# EAGLE design Adafruit TB6612 (EAGLE 6.6.0)
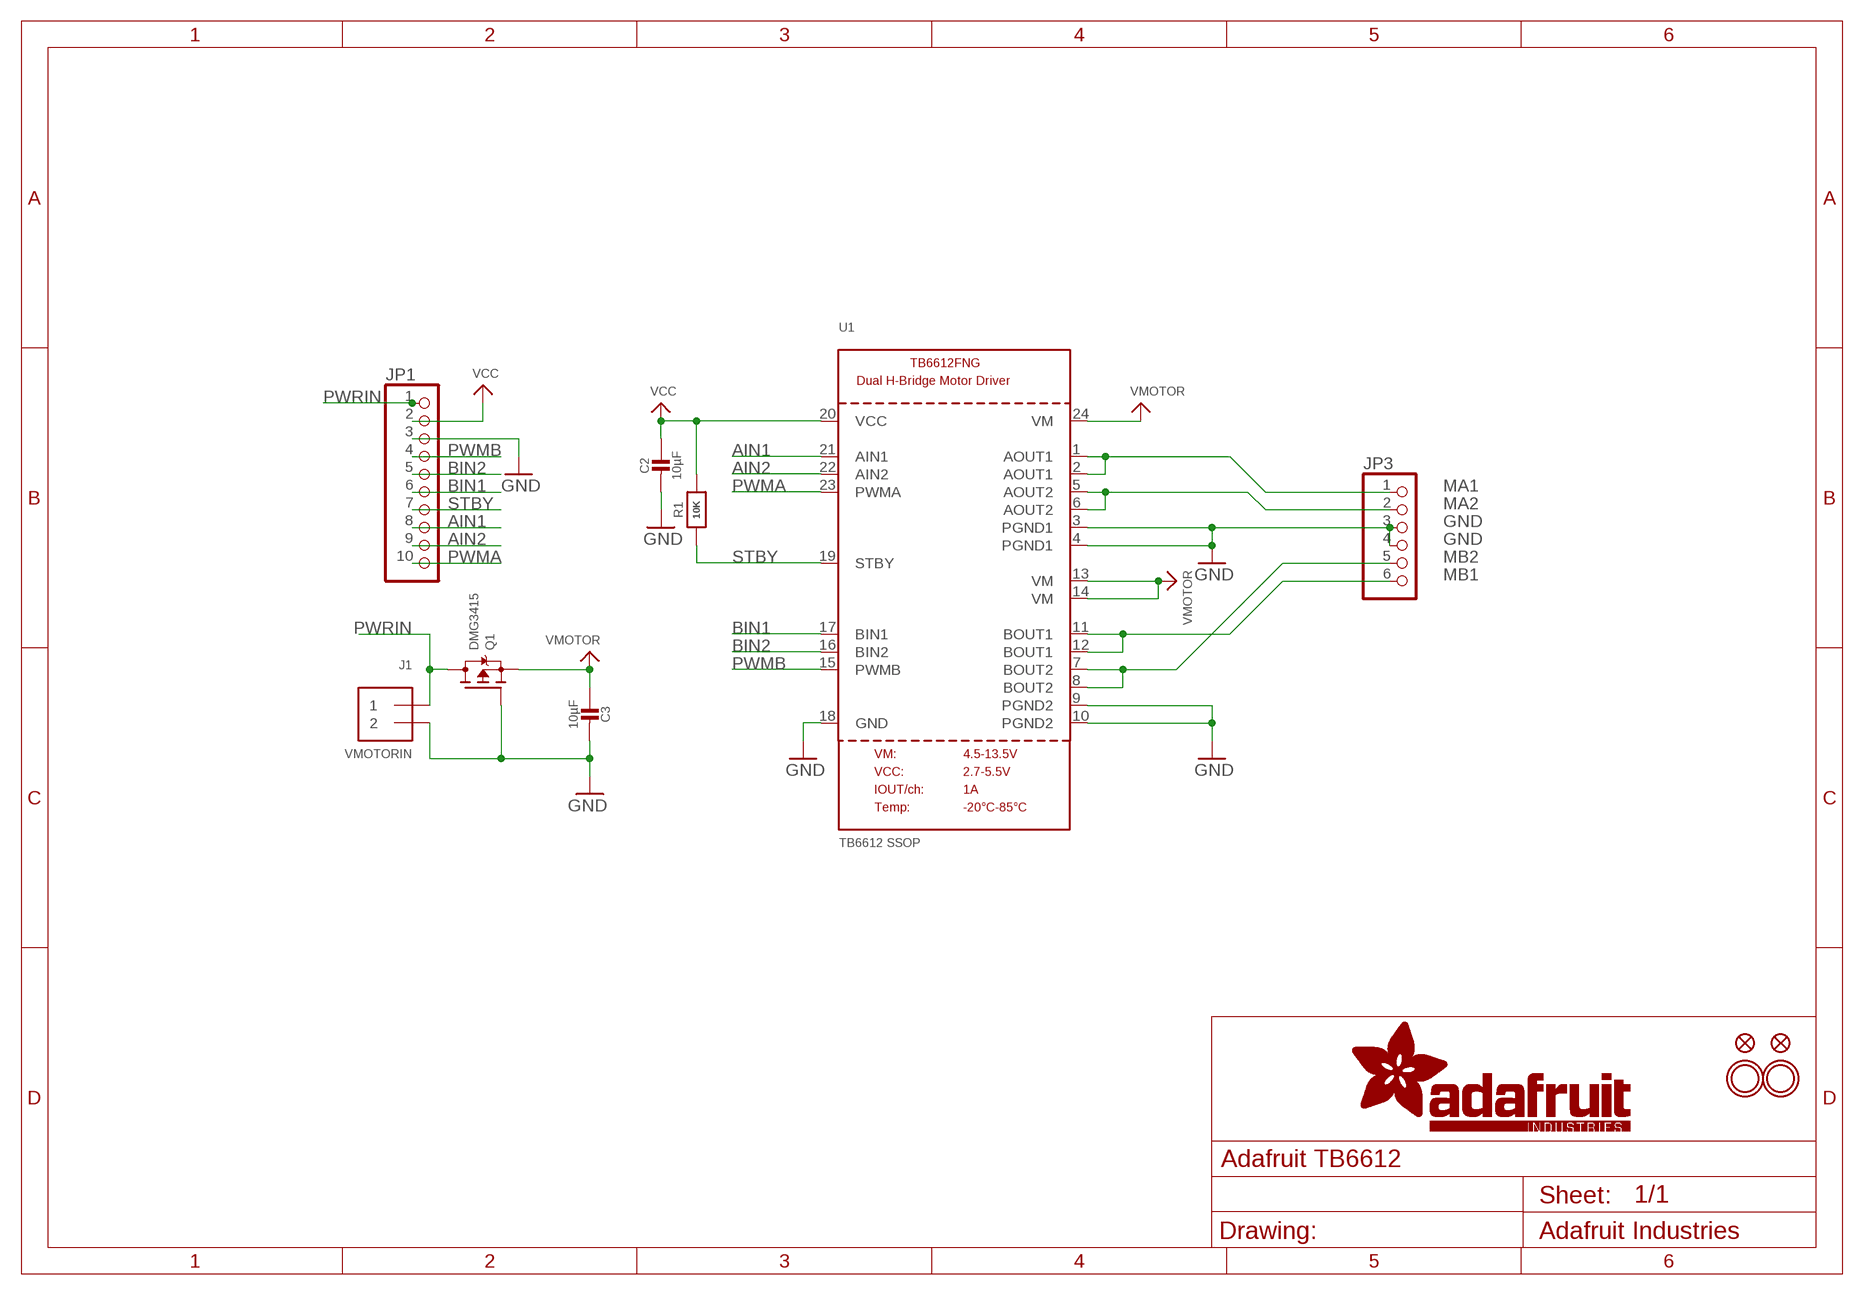
[diagram p0: schematic, sheet 1]

## Parts
C2  10µF  CAP_CERAMIC0805-NOOUTLINE  [0805-NO]
C3  10µF  CAP_CERAMIC0805-NOOUTLINE  [0805-NO]
FID1  FIDUCIAL""  [FIDUCIAL_1MM]
FID2  FIDUCIAL""  [FIDUCIAL_1MM]
J1  VMOTORIN  TERMBLOCK_1X2  [TERMBLOCK_1X2-3.5MM]
JP1  HEADER-1X10THICKER  [1X10_ROUND_76]
JP3  PINHD-1X6CB  [1X06-CLEANBIG]
Q1  DMG3415  MOSFET-PWIDE  [SOT23-WIDE]
R1  10K  RESISTOR0805_NOOUTLINE  [0805-NO]
U1  TB6612 SSOP  TB6612FNGSSOP  [SSOP24]
U$13  MOUNTINGHOLE2.5  [MOUNTINGHOLE_2.5_PLATED]
U$14  MOUNTINGHOLE2.5  [MOUNTINGHOLE_2.5_PLATED]

## Nets
AIN1: JP1.8 U1.21(AIN1)
AIN2: JP1.9 U1.22(AIN2)
BIN1: JP1.6 U1.17(BIN1)
BIN2: JP1.5 U1.16(BIN2)
GND: C2.2 C3.2 J1.2 JP1.3 JP3.3 JP3.4 Q1.1(G) U1.3(PGND1) U1.4(PGND1) U1.9(PGND2) U1.10(PGND2) U1.18(GND)
MA1: JP3.1 U1.1(AOUT1) U1.2(AOUT1)
MA2: JP3.2 U1.5(AOUT2) U1.6(AOUT2)
MB1: JP3.6 U1.11(BOUT1) U1.12(BOUT1)
MB2: JP3.5 U1.7(BOUT2) U1.8(BOUT2)
PWMA: JP1.10 U1.23(PWMA)
PWMB: JP1.4 U1.15(PWMB)
PWRIN: J1.1 JP1.1 Q1.3(D)
STBY: JP1.7 R1.1 U1.19(STBY)
VCC: C2.1 JP1.2 R1.2 U1.20(VCC)
VMOTOR: C3.1 Q1.2(S) U1.13(VM) U1.14(VM) U1.24(VM)

## Library data of the parts
C2 C3 = microbuilder:CAP_CERAMIC: Ceramic Capacitors For new designs, use the packages preceded by an '_' character since they are more reliable: The following footprints should be used on most boards: _0402 - Standard footprint for regular board layouts _0603 - Standard footprint for regular board layouts _0805 - Standard footprint for regular board layouts _1206 - Standard footprint for regular board layouts For extremely tight-pitch boards where space is at a premium, the following 'micro-pitch' footprints can be used (smaller pads, no silkscreen outline, etc.): _0402MP - Micro-pitch footprint for very dense/compact boards _0603MP - Micro-pitch footprint for very dense/compact boards _0805MP - Micro-pitch footprint for very dense/compact boards _1206MP - Micro-pitch footprint for very dense/compact boards
FID1 FID2 = microbuilder:FIDUCIAL: Fiducial Alignment Points Various fiducial points for machine vision alignment.; BOM: EXCLUDE
J1 = microbuilder:TERMBLOCK_1X2: 3.5mm Terminal block http://www.ladyada.net/library/pcb/eaglelibrary.html
JP1 = microbuilder:HEADER-1X10: PIN HEADER
JP3 = adafruit:PINHD-1X6: PIN HEADER
Q1 = microbuilder:MOSFET-P: P-Channel Mosfet LEGEND VDS: Voltage Drain-Source ID: Drain Current RDS(ON): Drain-Source On-State Resistance VGS(TH): Gate-Source Threshold Voltage CISS: Drain-Source Input Capacitance SOT-23 Name VDS ID RDS(ON) VGS(TH) CISS Order Number IRLML5103 30V 760mA 600 mOhm -- 75pF @ 25V Digikey: IRLML5103PBFCT-ND IRLML6401 12V 4.3A 50 mOhm 950mV @ 250µA 830pF @ 10V Digikey: IRLML6401PBFTR-ND NTR0202PL 20V 400mA 800 mOhm 2.3V @ 250uA 70pF @ 5V Digikey: NTR0202PLT1GOSTR-ND NTR4101PT1G 20V 1.8A 85 mOhm 1.2V @ 250uA 675pF @ 10V Digikey: NTR4101PT1GOSCT-ND DMP2004K 20V 600mA 900 mOhm 1V @ 250uA 175pF @ 16V Digikey: DMP2004KDICT-ND PMV65XP 20V 3.9A 76 mOhm 950mV @ 1mA 725pF @ 20V Digikey: 568-2358-2-ND TO-252 Name VDS ID RDS(ON) VGS(TH) CISS Order Number AOD417 30V 25A 34 mOhm 3V @ 250µA 920pF @ 15V Digikey: 785-1106-2-ND
R1 = microbuilder:RESISTOR: Resistors For new designs, use the packages preceded by an '_' character since they are more reliable: The following footprints should be used on most boards: _0402 - Standard footprint for regular board layouts _0603 - Standard footprint for regular board layouts _0805 - Standard footprint for regular board layouts _1206 - Standard footprint for regular board layouts For extremely tight-pitch boards where space is at a premium, the following 'micro-pitch' footprints can be used (smaller pads, no silkscreen outline, etc.): _0402MP - Micro-pitch footprint for very dense/compact boards _0603MP - Micro-pitch footprint for very dense/compact boards _0805MP - Micro-pitch footprint for very dense/compact boards _1206MP - Micro-pitch footprint for very dense/compact boards
U1 = microbuilder:TB6612FNG: TB6612FNG Dual H-Bridge Motor Driver
U$13 U$14 = microbuilder:MOUNTINGHOLE: Mounting Hole For #2 screws (0.086"/2.18mm width, 0.094"/2.4mm hole) use 2.5mm; BOM: EXCLUDE

## Board
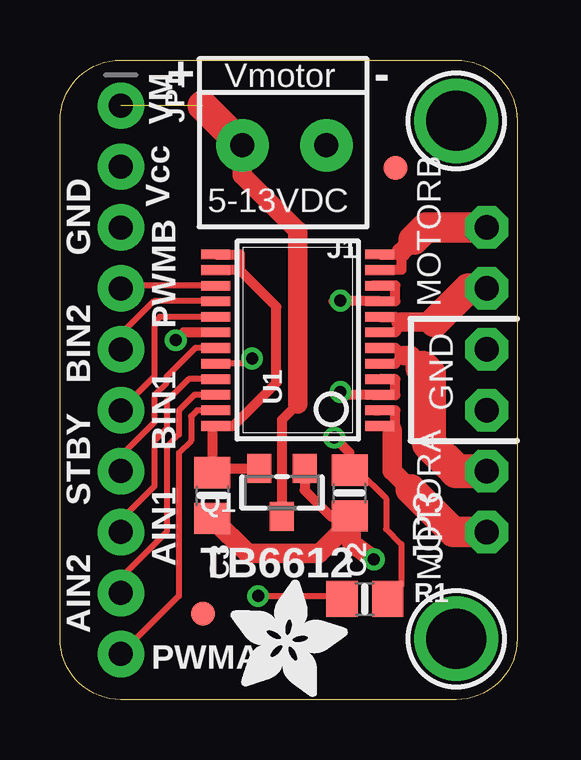
[diagram p1: board, top side]
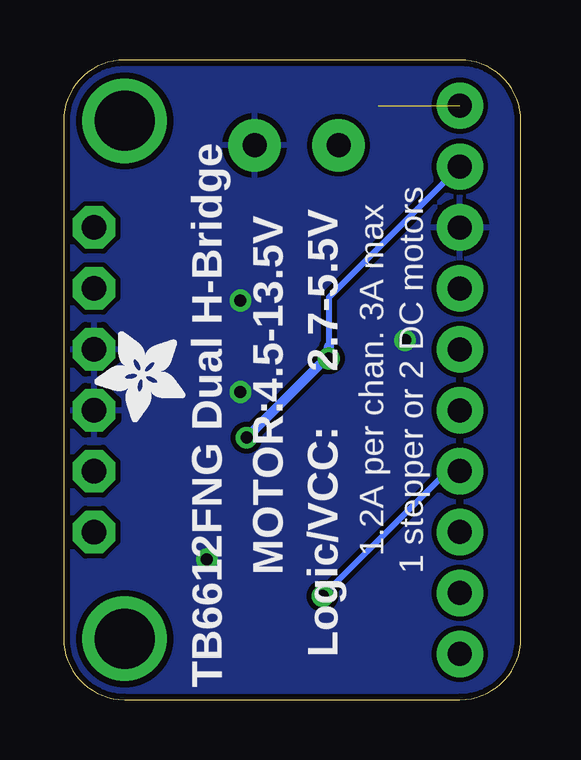
[diagram p2: board, bottom side, seen from below]

Size 19.05 x 26.67 mm. Coordinates in mm from the lower left corner, seen from the top.
Outline: 19.05,24.13 19.05,2.54 arc-90 16.51,0 2.54,0 arc-90 0,2.54 0,24.13 arc-90 2.54,26.67 16.51,26.67 arc-90 19.05,24.13
Copper layers (1*16): Top 0.035mm / dielectric 1.5mm / Bottom 0.035mm
Design rules "adafruit": minimum track width 8mil, minimum drill 15.5mil, track to track 8mil, track to pad 8mil, pad to pad 8mil, via to via 8mil, smd to smd 8mil, copper to edge 10mil, drill to drill 8mil, minimum pad ring 10mil, minimum via ring 8mil, stop-mask expansion 4mil, vias tented up to drill 20mil, thermal gap 10mil

### Footprints (pad centres in the part's own frame; a part is rotated, then mirrored left to right if it is on the bottom)
0805-NO = smd 1.3 x 1.5: 1 -0.95,0; 2 0.95,0
FIDUCIAL_1MM = smd 1 x 1: 1 0,0
TERMBLOCK_1X2-3.5MM = drill 1 pad 2.184: 1 1.8,0; 2 -1.7,0
1X10_ROUND_76 = drill 1 pad 1.93: 1 -11.43,0; 2 -8.89,0; 3 -6.35,0; 4 -3.81,0; 5 -1.27,0; 6 1.27,0; 7 3.81,0; 8 6.35,0; 9 8.89,0; 10 11.43,0
1X06-CLEANBIG = drill 1.016 pad 1.778 octagon: 1 -6.35,0; 2 -3.81,0; 3 -1.27,0; 4 1.27,0; 5 3.81,0; 6 6.35,0
SOT23-WIDE = smd 1 x 1.2: 1 -0.95,-1; 2 0.95,-1; 3 0,1
SSOP24 = smd 0.4 x 1.2: 1 -3.575,-3.42; 2 -2.925,-3.42; 3 -2.275,-3.42; 4 -1.625,-3.42; 5 -0.975,-3.42; 6 -0.325,-3.42; 7 0.325,-3.42; 8 0.975,-3.42; 9 1.625,-3.42; 10 2.275,-3.42; 11 2.925,-3.42; 12 3.575,-3.42; 13 3.575,3.42; 14 2.925,3.42; 15 2.275,3.42; 16 1.625,3.42; 17 0.975,3.42; 18 0.325,3.42; 19 -0.325,3.42; 20 -0.975,3.42; 21 -1.625,3.42; 22 -2.275,3.42; 23 -2.925,3.42; 24 -3.575,3.42
MOUNTINGHOLE_2.5_PLATED = drill 2.5 pad 3.2: P$1 0,0

### Placement (x,y rotation side)
C2  12.06,8.61 270 top
C3  6.35,8.51 270 top
FID1  5.95,3.6 0 top
FID2  13.98,22.17 0 top
J1  9.4,23.11 180 top
JP1  2.54,13.34 270 top
JP3  17.78,13.34 90 top
Q1  9.25,8.64 180 top
R1  12.7,4.19 0 top
U1  9.91,14.99 90 top
U$11  [ADAFRUIT_3.5MM]  13.97,15.37 180 bottom
U$13  16.51,24.13 0 top
U$14  16.51,2.54 0 top
U$15  [ADAFRUIT_5MM]  7.11,0.13 0 top

### Tracks (layer width: path | path; a pad name or v marks a point on that pad's centre or on a via)
AIN1
  Top 0.254: U1.21 5.36,13.36 4.45,12.45 4.45,11.3 3.94,10.79 3.94,8.89 2.54,7.49 JP1.8
AIN2
  Top 0.254: U1.22 5.6,12.71 4.95,12.06 4.95,11.05 4.45,10.54 4.45,6.99 2.54,5.08 JP1.9
BIN1
  Top 0.254: U1.17 4.15,15.96 3.94,15.75 3.94,13.46 JP1.6
BIN2
  Top 0.254: U1.16 3.91,16.61 2.54,15.24 JP1.5
GND  (via drill 0.5)
  Top 0.254: 12.06,7.37 C2.2 12.02,7.62
  Top 0.406: U1.3 13.07,12.7 | 13.07,12.7 13.97,12.7 13.97,13.36 U1.4 | 13.07,12.7 11.81,12.7 v11.68,12.83 | U1.10 13.07,17.27 13.97,17.27 13.97,16.61 U1.9 11.4,16.61 v11.68,16.64 | U1.18 5.14,15.31 v4.83,14.99 | Q1.1 10.2,8.73 11.3,7.62 12.02,7.62
  Top 0.813: v13.08,5.84 12.15,6.52 C2.2 | C3.2 7.81,6.1 10.79,6.1 12.06,7.37
  Bottom 0.406: v13.08,5.84 13.08,5.97 | v4.83,14.99 4.95,14.99
  pour Bottom: 0,0 0,26.73 19.11,26.73 18.86,0
MA1
  Top 0.254: U1.1 13.84,11.41 | 13.84,11.41 13.84,11.22 | 13.97,11.41 13.84,11.41
  Top 0.406: 13.97,11.41 13.97,12.06 13.07,12.06 U1.2
  Top 0.813: 13.84,11.22 13.84,9.53 14.61,8.76
  Top 1.27: 14.61,8.76 16.38,6.99 JP3.1
MA2
  Top 0.406: U1.5 13.97,14.01 14.35,14.35 13.97,14.66 U1.6
  Top 0.813: 14.35,14.35 14.61,14.35 15.11,13.84
  Top 1.422: 15.11,13.84 15.37,13.59 15.37,10.67 16.51,9.53 JP3.2
MB1
  Top 0.406: U1.12 13.97,18.56 14.22,18.67 14.22,17.91 U1.11
  Top 0.813: 14.22,18.67 14.73,19.18
  Top 1.27: 14.73,19.18 15.24,19.68 JP3.6
MB2
  Top 0.406: U1.8 13.97,15.96 14.22,15.75 13.97,15.31 U1.7
  Top 0.813: 15.62,15.75 14.22,15.75
  Top 1.27: JP3.5 17.02,17.14 15.62,15.75
PWMA
  Top 0.254: U1.23 5.71,12.06 5.46,11.81 5.46,10.79 4.95,10.29 4.95,4.32 JP1.10
PWMB
  Top 0.254: U1.15 2.66,17.26 JP1.4
PWRIN  (1 unrouted)
  Top 0.406: 9.91,12.32 9.25,11.66 Q1.3
  Top 0.813: 9.91,12.32 9.91,19.56 7.6,21.87 J1.1
  Top 1.27: 5.95,24.77 J1.1
STBY  (via drill 0.5)
  Top 0.254: U1.19 5.64,14.66 4.45,13.46 4.45,13.21 3.94,12.7 3.94,11.56 2.54,10.16 JP1.7 | v8.26,4.32 11.62,4.32 R1.1
  Bottom 0.254: JP1.7 3.05,9.53 v8.26,4.32
VCC  (via drill 0.5)
  Top 0.254: v8,14.22 7.79,14.01 U1.20 | C2.1 12.41,9.56 13.59,8.38 13.59,7.11 14.22,6.48 14.22,4.76 R1.2
  Top 0.406: C2.1 12.06,10.29 v11.43,10.92
  Bottom 0.254: JP1.2 8,16.76 8,14.73 v8,14.22
  Bottom 0.406: v11.43,10.92 8,14.35 8,14.73
VMOTOR
  Top 0.406: U1.13 7.49,18.56 7.49,17.91 | 7.49,17.91 6.23,17.91 U1.14 | 7.49,17.91 9.02,16.38 9.02,13.21 7.22,11.41 U1.24 6.35,11.28 C3.1 6.53,9.64 Q1.2

### Text on the board
tPlace: + | Vmotor | - | VM | Vcc | 5-13VDC | GND | MOTORB | PWMB | BIN2 | GND | BIN1 | STBY | AIN1 | TB6612 | MOTORA | AIN2 | PWMA
bPlace: 2.7-5.5V | 1 stepper or 2 DC motors | 1.2A per chan. 3A max | 4.5-13.5V | MOTOR: | Logic/VCC: | TB6612FNG Dual H-Bridge